# EAGLE design dev (EAGLE 4.16)
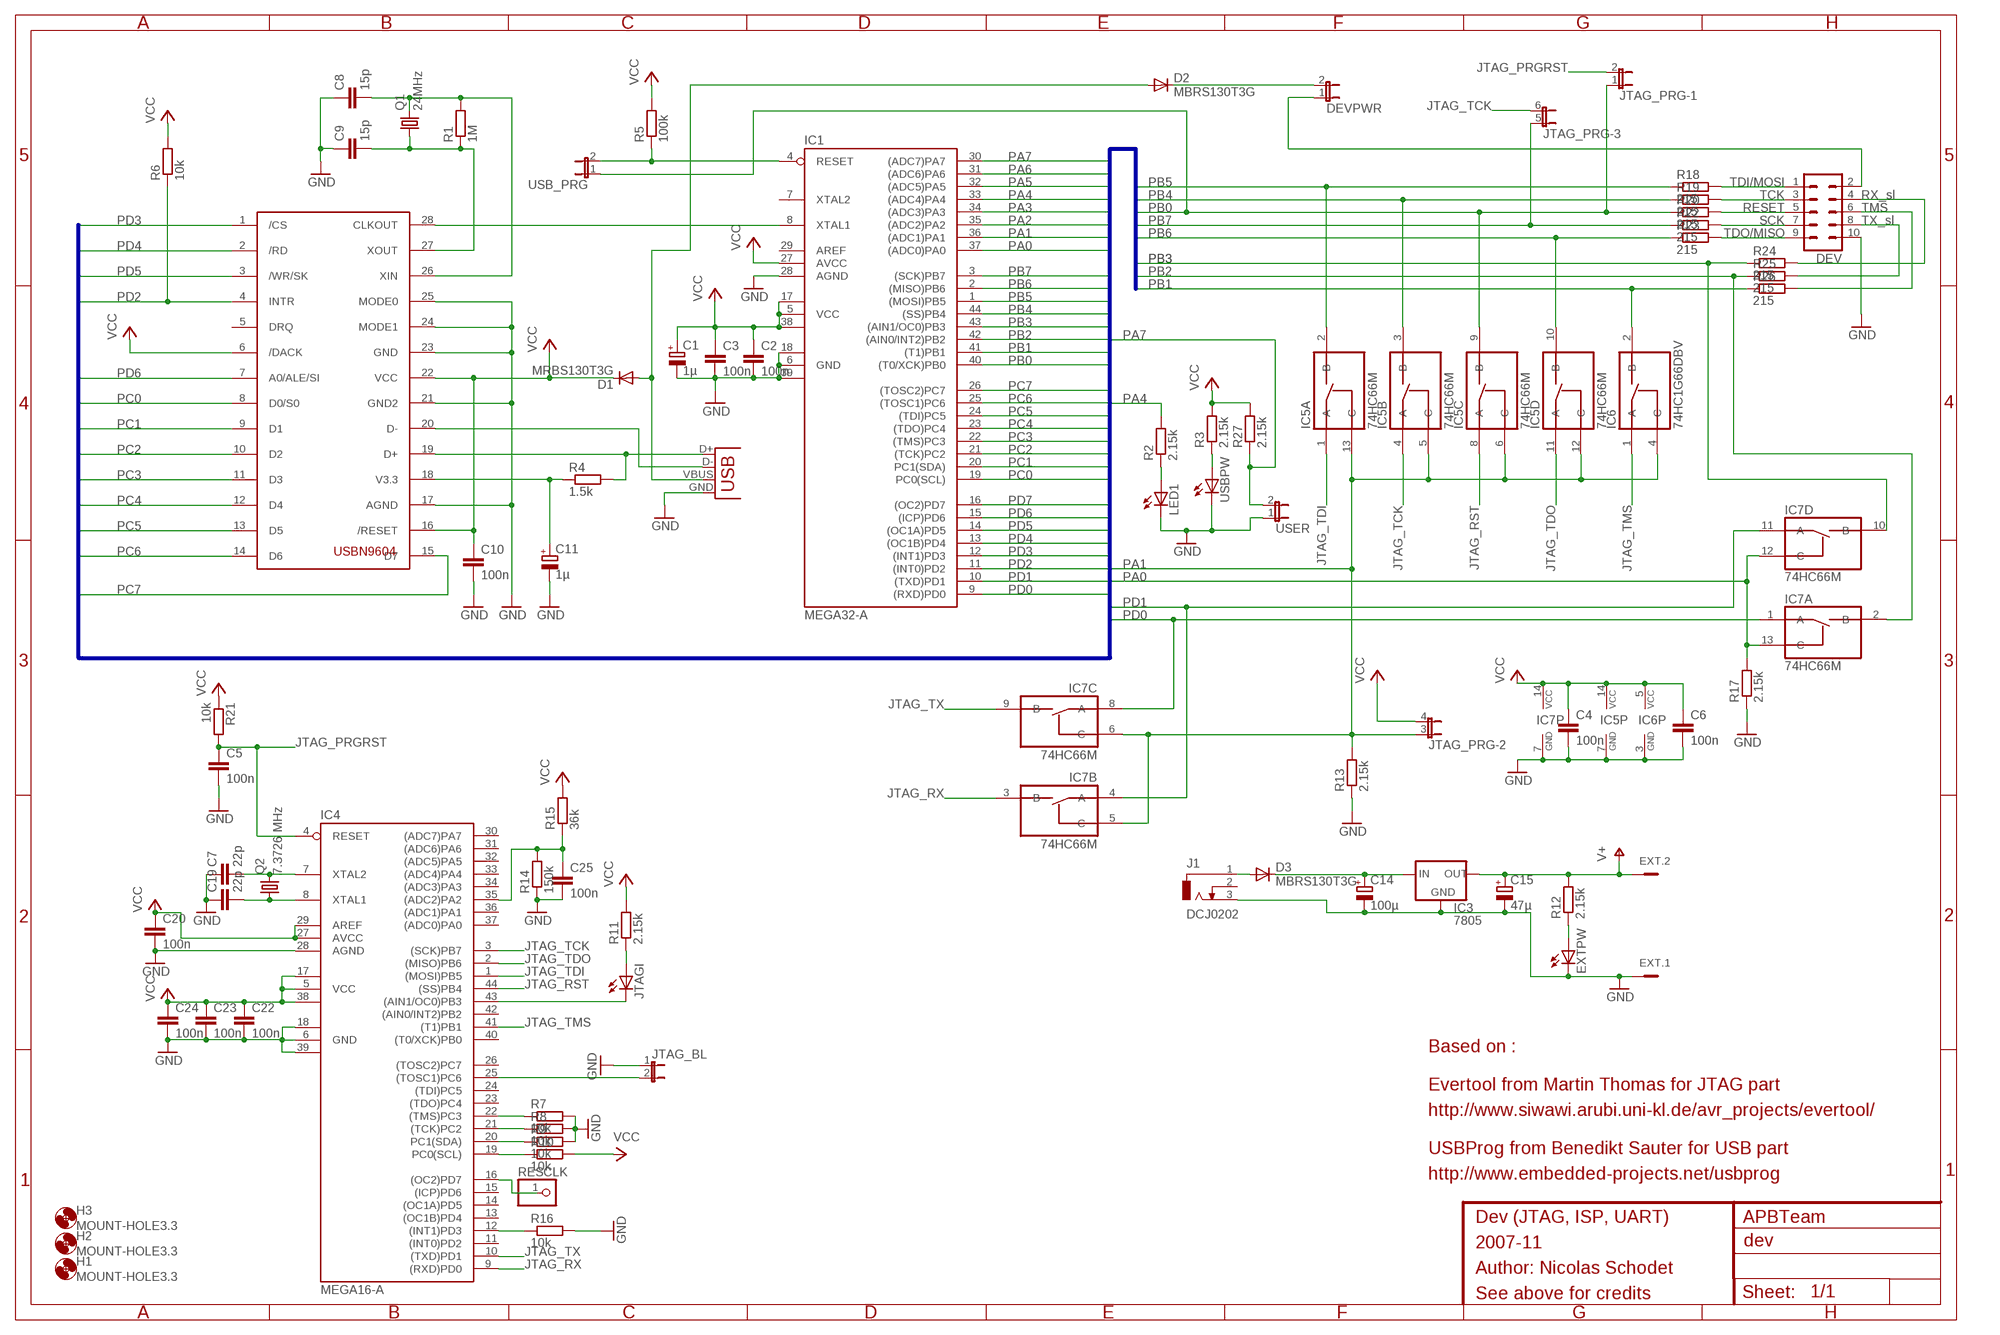
[diagram p0: schematic, sheet 1]

## Parts
C1  1µ  CPOL-EUCT3528  [CT3528]
C2  100n  C-EUC0603  [C0603]
C3  100n  C-EUC0603  [C0603]
C4  100n  C-EUC0603  [C0603]
C5  100n  C-EUC0603  [C0603]
C6  100n  C-EUC0603  [C0603]
C7  22p  C-EUC0603  [C0603]
C8  15p  C-EUC0603  [C0603]
C9  15p  C-EUC0603  [C0603]
C10  100n  C-EUC0603  [C0603]
C11  1µ  CPOL-EUCT3528  [CT3528]
C14  100µ  CPOL-EUD  [PANASONIC_D]
C15  47µ  CPOL-EUC  [PANASONIC_C]
C19  22p  C-EUC0603  [C0603]
C20  100n  C-EUC0603  [C0603]
C22  100n  C-EUC0603  [C0603]
C23  100n  C-EUC0603  [C0603]
C24  100n  C-EUC0603  [C0603]
C25  100n  C-EUC0603  [C0603]
D1  MRBS130T3G  DIODE-MELF-MLL41  [MELF-MLL41]
D2  MBRS130T3G  DIODE-MELF-MLL41  [MELF-MLL41]
D3  MBRS130T3G  DIODE-MELF-MLL41  [MELF-MLL41]
DEV  ML10L  [ML10L]
DEVPWR  JP1E  [JP1]
EXT  MC2  [MC2]
EXTPW  LEDSMT1206  [1206]
H1  MOUNT-HOLE3.3  [3,3]
H2  MOUNT-HOLE3.3  [3,3]
H3  MOUNT-HOLE3.3  [3,3]
IC1  MEGA32-A  [TQFP44]
IC2  USBN9604  [SO28-3]
IC3  7805  78XXS  [78XXS]
IC4  MEGA16-A  [TQFP44]
IC5  74HC66M  [SO14]
IC6  74HC1G66DBV  [SOT23-5]
IC7  74HC66M  [SO14]
J1  DCJ0202  [DCJ0202]
JTAG_BL  JP1E  [JP1]
JTAG_PRG  JP3QE  [JP3Q]
JTAGI  LEDSMT1206  [1206]
LED1  LEDSMT1206  [1206]
Q1  24MHz  CRYTALHC49U70  [HC49U70]
Q2  7.3726 MHz  CRYTALHC49U70  [HC49U70]
R1  1M  R-EU_R0603  [R0603]
R2  2.15k  R-EU_R0603  [R0603]
R3  2.15k  R-EU_R0603  [R0603]
R4  1.5k  R-EU_R0603  [R0603]
R5  100k  R-EU_R0603  [R0603]
R6  10k  R-EU_R0603  [R0603]
R7  10k  R-EU_R0603  [R0603]
R8  10k  R-EU_R0603  [R0603]
R9  10k  R-EU_R0603  [R0603]
R10  10k  R-EU_R0603  [R0603]
R11  2.15k  R-EU_R0603  [R0603]
R12  2.15k  R-EU_R0603  [R0603]
R13  2.15k  R-EU_R0603  [R0603]
R14  150k  R-EU_R0603  [R0603]
R15  36k  R-EU_R0603  [R0603]
R16  10k  R-EU_R0603  [R0603]
R17  2.15k  R-EU_R0603  [R0603]
R18  215  R-EU_R0603  [R0603]
R19  215  R-EU_R0603  [R0603]
R20  215  R-EU_R0603  [R0603]
R21  10k  R-EU_R0603  [R0603]
R22  215  R-EU_R0603  [R0603]
R23  215  R-EU_R0603  [R0603]
R24  215  R-EU_R0603  [R0603]
R25  215  R-EU_R0603  [R0603]
R26  215  R-EU_R0603  [R0603]
R27  2.15k  R-EU_R0603  [R0603]
RESCLK  PINHD-1X1  [1X01]
USB  USB-B-H  [USB-B-H]
USB_PRG  JP1E  [JP1]
USBPW  LEDSMT1206  [1206]
USER  JP1E  [JP1]

## Nets
GND: C1.- C2.2 C3.2 C4.2 C5.2 C6.2 C7.1 C8.1 C9.1 C10.2 C11.- C14.- C15.- C19.1 C20.2 C22.2 C23.2 C24.2 C25.2 DEV.10 EXT.1 EXTPW.C IC1.6(GND) IC1.18(GND1) IC1.28(AGND) IC1.39(GND2) IC2.17(AGND) IC2.21(GND2) IC2.23(GND) IC2.24(MODE1) IC2.25(MODE0) IC3.GND IC4.6(GND) IC4.18(GND1) IC4.28(AGND) IC4.39(GND2) IC5.7(P:GND) IC6.3(GND) IC7.7(P:GND) J1.3 JTAG_BL.1 LED1.C R7.2 R8.2 R9.2 R13.1 R14.1 R16.2 R17.1 USB.GND USBPW.C USER.1
JTAG_PRGRST: C5.1 IC4.4(RESET) JTAG_PRG.2 R21.2
JTAG_RST: IC4.44((SS)PB4) IC5.8(C:A)
JTAG_RX: IC4.9((RXD)PD0) IC7.3(B:B)
JTAG_TCK: IC4.3((SCK)PB7) IC5.4(B:A) JTAG_PRG.6
JTAG_TDI: IC4.1((MOSI)PB5) IC5.1(A:A)
JTAG_TDO: IC4.2((MISO)PB6) IC5.11(D:A)
JTAG_TMS: IC4.41((T1)PB1) IC6.1(A)
JTAG_TX: IC4.10((TXD)PD1) IC7.9(C:B)
N$1: D1.A D2.A USB.VBUS
N$2: DEV.2 DEVPWR.1
N$3: D2.C DEVPWR.2
N$4: IC1.8(XTAL1) IC2.28(CLKOUT)
N$5: DEV.9 R23.2
N$6: DEV.7 R22.2
N$7: C11.+ IC2.18(V3.3) R4.1
N$8: C8.2 IC2.26(XIN) Q1.2 R1.2
N$9: LED1.A R2.1
N$10: R3.1 USBPW.A
N$11: C9.2 IC2.27(XOUT) Q1.1 R1.1
N$12: IC2.19(D+) R4.2 USB.D+
N$13: IC4.22((TMS)PC3) R7.1
N$14: IC4.21((TCK)PC2) R8.1
N$15: IC2.20(D-) USB.D-
N$16: IC4.20(PC1(SDA)) R9.1
N$17: IC4.19(PC0(SCL)) R10.1
N$18: JTAGI.A R11.1
N$19: DEV.5 R20.2
N$20: DEV.3 R19.2
N$21: IC4.16((OC2)PD7) RESCLK.1
N$22: IC4.12((INT1)PD3) R16.1
N$23: C25.1 IC4.35((ADC2)PA2) R14.2 R15.1
N$24: IC4.25((TOSC1)PC6) JTAG_BL.2
N$25: DEV.1 R18.2
N$26: DEV.4 R24.2
N$27: D3.A J1.1
N$28: DEV.8 R25.2
N$29: DEV.6 R26.2
N$32: IC4.43((AIN1/OC0)PB3) JTAGI.C
N$33: C14.+ D3.C IC3.IN
N$36: EXTPW.A R12.1
N$53: C7.2 IC4.7(XTAL2) Q2.2
N$54: C19.2 IC4.8(XTAL1) Q2.1
PA0: IC1.37((ADC0)PA0) IC7.12(D:C) IC7.13(A:C) R17.2
PA1: IC1.36((ADC1)PA1) IC5.5(B:C) IC5.6(C:C) IC5.12(D:C) IC5.13(A:C) IC6.4(C) IC7.5(B:C) IC7.6(C:C) JTAG_PRG.3 R13.2
PA2: IC1.35((ADC2)PA2)
PA3: IC1.34((ADC3)PA3)
PA4: IC1.33((ADC4)PA4) R2.2
PA5: IC1.32((ADC5)PA5)
PA6: IC1.31((ADC6)PA6)
PA7: IC1.30((ADC7)PA7) R27.1 USER.2
PB0: IC1.40((T0/XCK)PB0) IC5.9(C:B) JTAG_PRG.1 R20.1 USB_PRG.1
PB1: IC1.41((T1)PB1) IC6.2(B) R26.1
PB2: IC1.42((AIN0/INT2)PB2) IC7.2(A:B) R25.1
PB3: IC1.43((AIN1/OC0)PB3) IC7.10(D:B) R24.1
PB4: IC1.44((SS)PB4) IC5.3(B:B) R19.1
PB5: IC1.1((MOSI)PB5) IC5.2(A:B) R18.1
PB6: IC1.2((MISO)PB6) IC5.10(D:B) R23.1
PB7: IC1.3((SCK)PB7) JTAG_PRG.5 R22.1
PC0: IC1.19(PC0(SCL)) IC2.8(D0/S0)
PC1: IC1.20(PC1(SDA)) IC2.9(D1)
PC2: IC1.21((TCK)PC2) IC2.10(D2)
PC3: IC1.22((TMS)PC3) IC2.11(D3)
PC4: IC1.23((TDO)PC4) IC2.12(D4)
PC5: IC1.24((TDI)PC5) IC2.13(D5)
PC6: IC1.25((TOSC1)PC6) IC2.14(D6)
PC7: IC1.26((TOSC2)PC7) IC2.15(D7)
PD0: IC1.9((RXD)PD0) IC7.1(A:A) IC7.8(C:A)
PD1: IC1.10((TXD)PD1) IC7.4(B:A) IC7.11(D:A)
PD2: IC1.11((INT0)PD2) IC2.4(INTR) R6.1
PD3: IC1.12((INT1)PD3) IC2.1(/CS)
PD4: IC1.13((OC1B)PD4) IC2.2(/RD)
PD5: IC1.14((OC1A)PD5) IC2.3(/WR/SK)
PD6: IC1.15((ICP)PD6) IC2.7(A0/ALE/SI)
PD7: IC1.16((OC2)PD7)
RESET: IC1.4(RESET) R5.1 USB_PRG.2
V+ [supply]: C15.+ EXT.2 IC3.OUT R12.2
VCC: C1.+ C2.1 C3.1 C4.1 C6.1 C10.1 C20.1 C22.1 C23.1 C24.1 D1.C IC1.5(VCC) IC1.17(VCC1) IC1.27(AVCC) IC1.38(VCC2) IC2.6(/DACK) IC2.16(/RESET) IC2.22(VCC) IC4.5(VCC) IC4.17(VCC1) IC4.27(AVCC) IC4.29(AREF) IC4.38(VCC2) IC5.14(P:VCC) IC6.5(VCC) IC7.14(P:VCC) JTAG_PRG.4 R3.2 R5.2 R6.2 R10.2 R11.2 R15.2 R21.1 R27.2
Unconnected: IC1.7(XTAL2) IC2.5(DRQ) IC4.11((INT0)PD2) IC4.13((OC1B)PD4) IC4.14((OC1A)PD5) IC4.15((ICP)PD6) IC4.23((TDO)PC4) IC4.24((TDI)PC5) IC4.26((TOSC2)PC7) IC4.30((ADC7)PA7) IC4.31((ADC6)PA6) IC4.32((ADC5)PA5) IC4.33((ADC4)PA4) IC4.34((ADC3)PA3) IC4.36((ADC1)PA1) IC4.37((ADC0)PA0) IC4.40((T0/XCK)PB0) IC4.42((AIN0/INT2)PB2) J1.2

## Buses
PD0,PD1,PD2,PD3,PD4,PD5,PD6,PD7,PC0,PC1,PC2,PC3,PC4,PC5,PC6,PC7,PB0,PB1,PB2,PB3,PB4,PB5,PB6,PB7,PA0,PA1,PA2,PA3,PA4,PA5,PA6,PA7

## Notes on the sheet
- TDI/MOSI
- PB4 | TCK | RX_sl
- RESET | TMS
- SCK | TX_sl
- TDO/MISO
- PB3 | PB3
- PB2
- PB1
- Based on :
- Evertool from Martin Thomas for JTAG part
- http://www.siwawi.arubi.uni-kl.de/avr_projects/evertool/
- USBProg from Benedikt Sauter for USB part
- http://www.embedded-projects.net/usbprog
- Dev (JTAG, ISP, UART) | APBTeam
- 2007-11
- Author: Nicolas Schodet
- See above for credits

## Power pins joined to a net without a drawn wire
AREF: IC1.29(AREF)

## Library data of the parts
C1 C11 C14 C15 = rcl:CPOL-EU: POLARIZED CAPACITOR, European symbol
C2-C10 C19 C20 C22-C25 = rcl:C-EU: CAPACITOR, European symbol
D1-D3 = diode:DIODE-: DIODE
DEV = con-harting-ml:ML10: HARTING
DEVPWR JTAG_BL USB_PRG USER = jumper:JP1E: JUMPER
EXT = con-phoenix-381_l:MC2: Mini-Combicon 3.81mm horizontal 2-polig MC 1,5/2-G-3,81 Artikel-Nr. 1803277
EXTPW JTAGI LED1 USBPW = led:LED: LED OSRAM: - CHIPLED LG R971, LG N971, LY N971, LG Q971, LY Q971, LO R971, LY R971 LH N974, LH R974 LS Q976, LO Q976, LY Q976 LO Q996 - Hyper CHIPLED LW Q18S LB Q993, LB Q99A, LB R99A - SideLED LS A670, LO A670, LY A670, LG A670, LP A670 LB A673, LV A673, LT A673, LW A673 LH A674 LY A675 LS A676, LA A676, LO A676, LY A676, LW A676 LS A679, LY A679, LG A679 - Hyper Micro SIDELED® LS Y876, LA Y876, LO Y876, LY Y876 LT Y87S - SmartLED LW L88C, LW L88S LB L89C, LB L89S, LG L890 LS L89K, LO L89K, LY L89K LS L896, LA L896, LO L896, LY L896 - TOPLED LS T670, LO T670, LY T670, LG T670, LP T670 LSG T670, LSP T670, LSY T670, LOP T670, LYG T670 LG T671, LOG T671, LSG T671 LB T673, LV T673, LT T673, LW T673 LH T674 LS T676, LA T676, LO T676, LY T676, LB T676, LH T676, LSB T676, LW T676 LB T67C, LV T67C, LT T67C, LS T67K, LO T67K, LY T67K, LW E67C LS E67B, LA E67B, LO E67B, LY E67B, LB E67C, LV E67C, LT E67C LW T67C LS T679, LY T679, LG T679 LS T770, LO T770, LY T770, LG T770, LP T770 LB T773, LV T773, LT T773, LW T773 LH T774 LS E675, LA E675, LY E675, LS T675 LS T776, LA T776, LO T776, LY T776, LB T776 LHGB T686 LT T68C, LB T68C - Hyper Mini TOPLED® LB M676 - Mini TOPLED Santana® LG M470 LS M47K, LO M47K, LY M47K Source: http://www.osram.convergy.de/
H1-H3 = holes:MOUNT-HOLE: MOUNTING HOLE with drill center marker
IC1 = avr:MEGA32: MICROCONTROLLER 32 Kbytes FLASH 2 Kbytes SRAM 1 Kbytes EEPROM USART 8-channel 10 bit ADC
IC2 = bene:USBN9604
IC3 = v-reg:78XXS: VOLTAGE REGULATOR
IC4 = atmel:MEGA16: MICROCONTROLLER 16 Kbytes FLASH 1 kbytes SRAM 512 bytes EEPROM USART 8-channel 10 bit ADC Source: avr.lbr
IC5 IC7 = apbteam_logic:*66: Quad bilateral ANALOG SWITCH
IC6 = apbteam_logic:*1G66: Single bilateral ANALOG SWITCH
J1 = apbteam_con-jack:DCJ0202: DC POWER JACK Source: DCJ0202.pdf
JTAG_PRG = jumper:JP3QE: JUMPER
Q1 Q2 = crystal:CRYTAL: CRYSTAL
R1-R27 = rcl:R-EU_: RESISTOR, European symbol
RESCLK = pinhead:PINHD-1X1: PIN HEADER
USB = con-usb:USB: USB Connectors

## Net classes
1 supply: width 0.508 mm

## Board
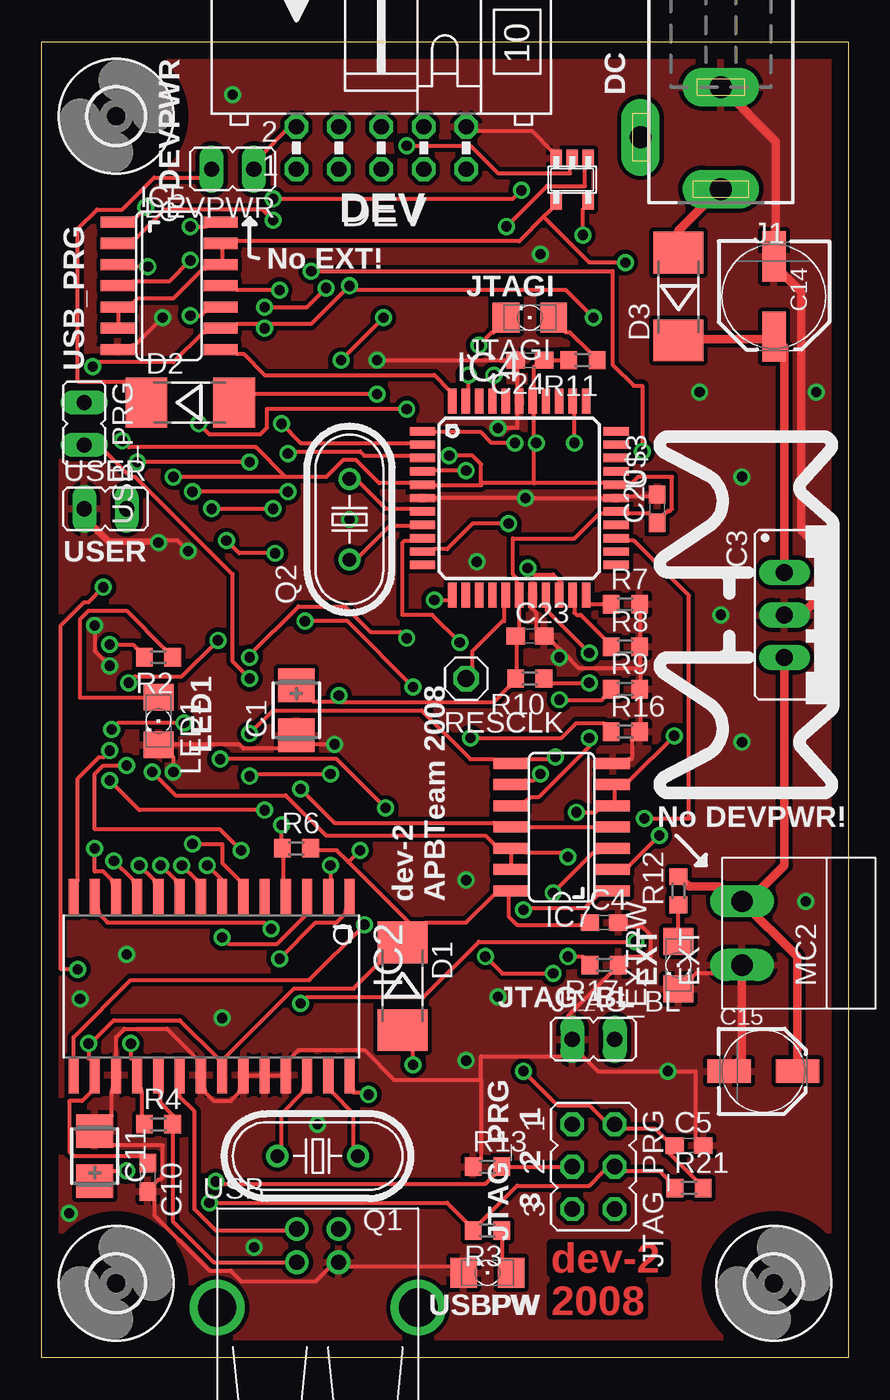
[diagram p1: board, top side]
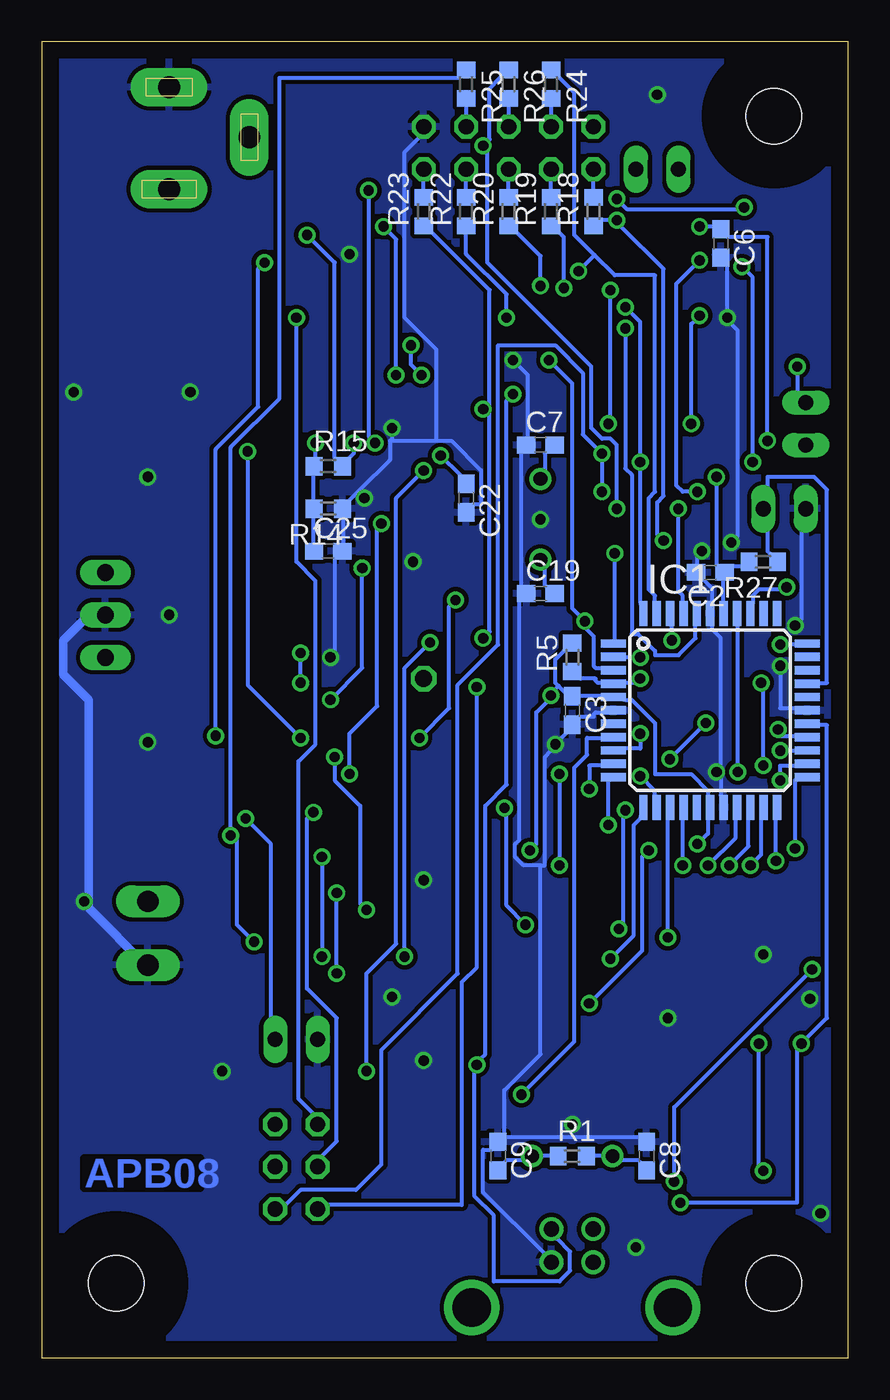
[diagram p2: board, bottom side, seen from below]

Size 48.26 x 78.74 mm. Coordinates in mm from the lower left corner, seen from the top.
Outline: 0,0 0,78.74 48.26,78.74 48.26,0 0,0
Copper layers (1*16): Top 0.035mm / dielectric 1.5mm / Bottom 0.035mm
Design rules "olimex": minimum track width 10mil, minimum drill 24mil, track to track 10mil, track to pad 10mil, pad to pad 10mil, via to via 10mil, smd to smd 10mil, copper to edge 40mil, drill to drill 10mil, minimum pad ring 10mil, minimum via ring 8mil, stop-mask expansion 0mil, vias tented up to drill 0mil, thermal gap 10mil

### Footprints (pad centres in the part's own frame; a part is rotated, then mirrored left to right if it is on the bottom)
CT3528 = smd 2 x 2.2: + 1.5,0; - -1.5,0
C0603 = smd 1.1 x 1: 1 -0.85,0; 2 0.85,0
PANASONIC_D = smd 3 x 1.4: + 2.4,0; - -2.4,0
PANASONIC_C = smd 2.6 x 1.4: + 2.05,0; - -2.05,0
MELF-MLL41 = smd 2.5 x 3: A 2.625,0; C -2.625,0
ML10L = drill 0.914 octagon: 1 -5.08,-1.27; 2 -5.08,1.27; 3 -2.54,-1.27; 4 -2.54,1.27; 5 0,-1.27; 6 0,1.27; 7 2.54,-1.27; 8 2.54,1.27; 9 5.08,-1.27; 10 5.08,1.27
JP1 = drill 0.914 long: 1 0,-1.27; 2 0,1.27
MC2 = drill 1.27 long: 1 -1.905,0; 2 1.905,0
1206 = smd 1.6 x 1.803: A -1.422,0; C 1.422,0
3,3 = hole 3.3: 0,0
TQFP44 = smd 1.5 x 0.5: 1 -5.8,4; 2 -5.8,3.2; 3 -5.8,2.4; 4 -5.8,1.6; 5 -5.8,0.8; 6 -5.8,0; 7 -5.8,-0.8; 8 -5.8,-1.6; 9 -5.8,-2.4; 10 -5.8,-3.2; 11 -5.8,-4; 23 5.8,-4; 24 5.8,-3.2; 25 5.8,-2.4; 26 5.8,-1.6; 27 5.8,-0.8; 28 5.8,0; 29 5.8,0.8; 30 5.8,1.6; 31 5.8,2.4; 32 5.8,3.2; 33 5.8,4 | smd 0.5 x 1.5: 12 -4,-5.8; 13 -3.2,-5.8; 14 -2.4,-5.8; 15 -1.6,-5.8; 16 -0.8,-5.8; 17 0,-5.8; 18 0.8,-5.8; 19 1.6,-5.8; 20 2.4,-5.8; 21 3.2,-5.8; 22 4,-5.8; 34 4,5.8; 35 3.2,5.8; 36 2.4,5.8; 37 1.6,5.8; 38 0.8,5.8; 39 0,5.8; 40 -0.8,5.8; 41 -1.6,5.8; 42 -2.4,5.8; 43 -3.2,5.8; 44 -4,5.8
SO28-3 = smd 0.61 x 2.21: 1 -8.255,-5.315; 2 -6.985,-5.315; 3 -5.715,-5.315; 4 -4.445,-5.315; 5 -3.175,-5.315; 6 -1.905,-5.315; 7 -0.635,-5.315; 8 0.635,-5.315; 9 1.905,-5.315; 10 3.175,-5.315; 11 4.445,-5.315; 12 5.715,-5.315; 13 6.985,-5.315; 14 8.255,-5.315; 15 8.255,5.315; 16 6.985,5.315; 17 5.715,5.315; 18 4.445,5.315; 19 3.175,5.315; 20 1.905,5.315; 21 0.635,5.315; 22 -0.635,5.315; 23 -1.905,5.315; 24 -3.175,5.315; 25 -4.445,5.315; 26 -5.715,5.315; 27 -6.985,5.315; 28 -8.255,5.315
78XXS = drill 1.016 long: GND 0,-2.54; IN -2.54,-2.54; OUT 2.54,-2.54
SO14 = smd 0.66 x 2.032: 1 -3.81,-3.073; 2 -2.54,-3.073; 3 -1.27,-3.073; 4 0,-3.073; 5 1.27,-3.073; 6 2.54,-3.073; 7 3.81,-3.073; 8 3.81,3.073; 9 2.54,3.073; 10 1.27,3.073; 11 0,3.073; 12 -1.27,3.073; 13 -2.54,3.073; 14 -3.81,3.073
SOT23-5 = smd 0.69 x 0.99: 1 -0.95,-1.29; 2 0,-1.29; 3 0.95,-1.29; 4 0.95,1.3; 5 -0.95,1.3
DCJ0202 = drill 1.3 pad 2.3 long: 1 0,3.1; 2 4.8,0; 3 0,-3
JP3Q = drill 0.914 octagon: 1 -2.54,-1.27; 2 -2.54,1.27; 3 0,-1.27; 4 0,1.27; 5 2.54,-1.27; 6 2.54,1.27
HC49U70 = drill 0.813 round: 1 -2.413,0; 2 2.413,0
R0603 = smd 1 x 1.1: 1 -0.85,0; 2 0.85,0
1X01 = drill 1.016 octagon: 1 0,0
USB-B-H = drill 0.914 round: D+ 0,1.25; D- 1.981,1.25; GND 0,-1.25; VBUS 1.981,-1.25 | drill 2.286 round: P$1 -2.718,-6.02; P$2 -2.718,6.02

### Placement (x,y rotation side)
C1  15.24,38.73 90 top
C2  8.26,46.99 180 bottom
C3  16.51,38.73 270 bottom
C4  33.66,26.04 0 top
C5  38.73,12.7 0 top
C6  7.62,66.67 270 bottom
C7  18.41,54.61 0 bottom
C8  12.06,12.06 270 bottom
C9  20.95,12.06 270 bottom
C10  6.35,10.79 270 top
C11  3.17,12.06 270 top
C14  43.81,63.5 270 top
C15  43.18,17.14 0 top
C19  18.41,45.72 0 bottom
C20  36.83,50.8 90 top
C22  22.86,51.44 270 bottom
C23  29.21,43.18 0 top
C24  29.21,59.69 180 top
C25  31.11,48.26 0 bottom
D1  21.59,22.23 270 top
D2  8.89,57.15 0 top
D3  38.1,63.5 90 top
DEV  20.32,72.39 0 top
DEVPWR  11.43,71.12 90 top
EXT  41.91,25.4 90 top
EXTPW  38.1,23.5 270 top
H1  4.45,74.3 0 top
H2  4.45,4.45 0 top
H3  43.81,4.45 0 top
IC1  8.26,38.73 0 bottom
IC2  10.16,22.23 180 top
IC3  46.99,44.45 270 top
IC4  28.57,51.44 0 top
IC5  7.62,64.14 270 top
IC6  31.75,70.48 180 top
IC7  31.11,31.75 90 top
J1  40.64,73.03 180 top
JTAG_BL  33.02,19.05 270 top
JTAG_PRG  33.02,11.43 270 top
JTAGI  29.21,62.23 180 top
LED1  6.99,38.1 270 top
Q1  16.51,12.06 180 top
Q2  18.41,50.16 90 top
R1  16.51,12.06 0 bottom
R2  6.99,41.91 180 top
R3  26.67,7.62 180 top
R4  6.99,13.97 0 top
R5  16.51,41.91 90 bottom
R6  15.24,30.48 0 top
R7  34.92,45.09 0 top
R8  34.92,42.55 0 top
R9  34.92,40.01 0 top
R10  29.21,40.64 180 top
R11  32.38,59.69 180 top
R12  38.1,27.94 90 top
R13  26.67,11.43 0 top
R14  31.11,50.8 180 bottom
R15  31.11,53.34 0 bottom
R16  34.92,37.47 0 top
R17  33.66,23.5 180 top
R18  15.24,68.58 90 bottom
R19  17.78,68.58 90 bottom
R20  20.32,68.58 90 bottom
R21  38.73,10.16 0 top
R22  22.86,68.58 90 bottom
R23  25.4,68.58 90 bottom
R24  17.78,76.2 270 bottom
R25  22.86,76.2 270 bottom
R26  20.32,76.2 270 bottom
R27  5.08,47.62 180 bottom
RESCLK  25.4,40.64 0 top
U$3  [PF752]  46.99,44.45 270 top
USB  16.51,5.71 90 top
USB_PRG  2.54,55.88 180 top
USBPW  26.67,5.08 180 top
USER  3.81,50.8 270 top

### Tracks (layer width: path | path; a pad name or v marks a point on that pad's centre or on a via)
GND  (via drill 0.61)
  Top 0.254: IC7.7 35.18,35.81 35.31,35.81 35.31,36.96 R16.2 35.81,37.97 35.81,39.5 R9.2 35.81,40.51 35.81,41.27 | IC4.18 29.21,44.96 29.59,44.58 29.59,43.56 C23.2 30.61,42.8 31.3,42.1 | 35.81,41.27 35.81,42.04 R8.2 35.81,43.05 35.81,44.58 R7.2 | 31.3,42.1 32.13,41.27 35.81,41.27 | C20.2 36.45,51.56 35.05,51.56 IC4.28 v28.96,51.44 IC4.6 | IC6.3 30.48,72.26 29.34,73.41 26.04,73.41 DEV.10 | v27.3,55.63 28.45,55.63 28.45,56.52 IC4.39 28.45,57.91 28.45,59.31 C24.2 v20.07,59.69 | v30.99,41.91 31.11,41.91 31.3,42.1 | v7.24,62.23 5.59,60.58 5.46,60.58 IC5.7 | v4.06,41.4 3.17,42.29 v3.17,43.81 | v17.53,36.7 16.26,36.7 C1.- 14.22,36.45 12.06,36.45 11.81,36.7 7.87,36.7 LED1.C 7.87,35.94 v7.87,35.05 | USBPW.C 24.51,5.46 18.41,5.46 USB.GND 17.14,5.33 16.38,4.57 11.94,4.57 11.3,5.21 10.03,5.21 6.73,8.51 6.73,9.4 C10.2 6.73,10.41 6.99,10.67 7.11,10.67 7.24,10.79 7.24,12.7 4.19,12.7 C11.- 4.19,14.48 4.19,15.88 IC2.17 4.45,19.18 4.95,19.68 7.49,19.68 9.27,17.91 IC2.21 9.78,15.88 10.29,15.37 11.3,15.37 11.81,15.88 IC2.23 12.32,16.89 13.08,16.89 IC2.24 13.59,16.89 14.35,16.89 IC2.25 14.86,17.91 15.37,18.41 19.3,18.41 21.08,16.64 26.29,16.64 | 26.29,16.64 26.29,18.03 31.11,18.03 JTAG_BL.1 | 26.29,16.64 26.29,11.94 R13.1 | C5.2 39.12,13.08 39.12,17.14 33.27,17.14 32.38,18.03 JTAG_BL.1 | JTAG_BL.1 31.5,20.45 34.04,22.99 R17.1 34.92,24 36.45,24 36.45,25.27 35.94,25.78 35.05,25.78 C4.2 | EXTPW.C 38.99,22.86 39.12,22.99 40.13,22.99 EXT.1 | v8.76,48.26 8.13,48.9 4.06,48.9 3.17,49.78 USER.1 3.05,49.66 3.94,48.77 v6.99,48.77
  Top 0.508: C15.- 41.91,17.93 EXT.1 | 43.94,65.79 43.93,65.79 C14.- 43.83,65.9 43.94,65.79 | IC3.GND 45.47,44.45 46.99,45.97 46.99,48.01 45.47,49.53 45.47,63.75 43.94,65.28 43.94,65.79 | 43.94,65.79 43.94,72.77 40.69,76.03 J1.3
  Bottom 0.254: 27.3,54.86 27.43,54.86 27.43,53.72 29.27,51.88 | 27.3,54.86 24.64,54.86 | 24.64,54.86 23.75,54.86 21.97,53.09 21.97,51.05 22.48,51.05 C22.2 | 29.27,51.88 29.84,51.31 R14.1 30.23,50.29 30.23,48.64 C25.2 30.73,47.88 30.73,42.16 v30.99,41.91 | v27.3,55.63 27.3,54.86 | 24.64,54.86 24.64,60.33 26.54,62.23 26.54,72.14 25.65,73.03 DEV.10 | v28.96,51.44 29.21,51.69 29.21,51.82 29.27,51.88 | C6.2 7.24,65.28 v7.24,62.23 6.99,61.85 6.6,61.47 6.6,49.15 v6.99,48.77 | v4.06,41.4 4.06,38.86 3.17,38.86 IC1.28 | v3.17,43.81 2.79,44.2 2.79,49.4 USER.1 | 7.62,35.05 7.62,43.05 8.13,43.56 8.13,43.81 IC1.39 8.13,45.21 8.13,46.01 C2.2 9.02,46.99 9.02,48.01 v8.76,48.26 | 7.62,35.05 7.62,33.66 IC1.18 | IC1.6 14.73,38.61 15.11,38.61 15.24,38.48 15.24,38.35 16.13,38.35 C3.2 16.89,37.34 v17.53,36.7 17.78,36.32 18.16,35.94 18.16,29.46 18.41,29.46 | 18.41,29.46 19.43,29.46 19.94,29.97 19.94,30.73 19.68,30.99 19.68,45.34 C19.1 19.56,46.1 19.56,54.23 C7.1 19.18,54.99 19.18,58.8 v20.07,59.69 | v7.87,35.05 7.62,35.05 | C8.1 12.45,13.21 20.57,13.21 C9.1 | C9.1 21.34,12.45 21.84,12.45 21.84,9.91 18.16,6.22 USB.GND | 18.41,29.46 18.41,18.16 20.57,16 20.57,13.46 C9.1
  Bottom 0.508: IC3.GND 45.47,44.45 46.99,42.93 46.99,40.89 45.47,39.37 45.47,26.92 41.91,23.37 EXT.1
  other vias: 5.08,24.13 10.79,20.32 25.4,17.78 16.51,13.97 12.7,6.6 39.37,57.78 41.91,52.7 41.91,36.83 40.64,44.45 45.72,27.3 46.35,57.78 37.47,17.14 27.3,21.59 25.4,28.57 29.84,66.04 26.04,47.62 18.41,50.16 11.43,75.56 2.29,21.46 1.65,8.64
  pour Top (isolate 0.254): 0,78.74 48.26,78.74 48.26,0 0,0
  pour Bottom (isolate 0.254): 0,78.74 48.26,78.74 48.26,0 0,0
JTAG_PRGRST  (via drill 0.61)
  Top 0.254: v25.4,53.09 23.5,53.09 IC4.4 | v28.83,17.14 30.86,15.11 32.77,15.11 33.66,14.22 JTAG_PRG.2 34.92,13.72 36.7,13.72 37.34,13.08 C5.1 37.47,12.32 39.12,10.67 R21.2
  Bottom 0.254: v25.4,53.09 27.05,51.44 27.05,24.77 28.83,22.99 v28.83,17.14
JTAG_RST
  Top 0.254: IC4.44 24.38,57.91 23.5,58.8 13.34,58.8 12.06,60.07 11.68,60.07 IC5.8
JTAG_RX  (via drill 0.61)
  Top 0.254: v25.02,42.8 23.37,44.45 21.59,44.45 21.59,48.77 21.72,48.9 22.1,48.9 IC4.9 | v26.54,24 27.56,22.99 v30.61,22.99 | v30.61,27.81 33.02,30.23 33.27,30.23 IC7.3
  Bottom 0.254: v25.02,42.8 26.54,41.27 v26.54,24 | v30.61,22.99 v30.61,27.81
JTAG_TCK  (via drill 0.61)
  Top 0.254: v14.73,54.1 14.86,54.23 19.05,54.23 19.3,53.98 22.1,53.98 IC4.3 | v8.89,65.66 7.62,64.39 5.46,64.39 IC5.4 | v14.73,51.82 v9.02,51.82
  Bottom 0.254: JTAG_PRG.6 33.66,9.14 32.77,10.03 29.46,10.03 27.94,11.56 27.94,18.41 23.37,22.99 23.37,40.26 20.95,42.67 20.95,60.58 17.53,60.58 15.88,58.93 15.88,55.24 v14.73,54.1 v14.73,51.82 | v8.89,65.66 10.29,64.26 10.29,52.2 9.91,51.82 v9.02,51.82
JTAG_TDI  (via drill 0.61)
  Top 0.254: v28.32,54.74 26.92,54.74 26.29,55.37 23.5,55.37 IC4.1 | v28.7,69.85 28.19,69.34 v13.84,69.34 | v6.22,68.83 5.59,68.2 5.46,68.2 IC5.1
  Bottom 0.254: v28.32,54.74 28.7,55.12 v28.7,69.85 | v13.84,69.34 13.21,68.71 6.22,68.71 v6.22,68.83
JTAG_TDO  (via drill 0.61)
  Top 0.254: v14.35,55.88 15.49,54.74 22.1,54.74 IC4.2 | v14.22,63.88 11.68,63.88 IC5.11
  Bottom 0.254: v14.35,55.88 14.22,56.01 v14.22,63.88
JTAG_TMS  (via drill 0.61)
  Top 0.254: v27.81,67.69 30.23,70.1 32.51,70.1 32.51,71.37 IC6.1 | v27.05,58.8 27.05,57.91 IC4.41
  Bottom 0.254: v27.81,67.69 27.05,66.93 v27.05,58.8
JTAG_TX  (via drill 0.61)
  Top 0.254: v27.94,49.91 25.78,49.91 24.26,48.39 23.5,48.39 IC4.10 | v29.84,34.92 29.46,34.54 28.96,34.54 IC7.9
  Bottom 0.254: v27.94,49.91 28.19,49.66 28.19,38.99 29.84,37.34 v29.84,34.92
N$1  (via drill 0.61)
  Top 0.254: v22.23,17.53 22.23,18.41 D1.A | v20.07,57.66 12.7,57.66 D2.A
  Bottom 0.254: USB.VBUS 17.4,7.11 16.64,6.35 16.64,5.21 17.27,4.57 21.21,4.57 21.21,8.51 22.35,9.65 22.35,17.4 v22.23,17.53 21.97,17.91 21.72,18.16 21.72,33.02 20.45,34.29 20.45,57.28 v20.07,57.66
N$2
  Top 0.254: DEVPWR.1 13.34,72.14 14.61,73.41 DEV.2
N$3
  Top 0.254: DEVPWR.2 9.53,70.61 6.73,70.61 4.83,68.71 3.3,68.71 2.16,67.56 2.16,58.42 5.08,58.42 D2.C
N$4  (via drill 0.61)
  Top 0.254: v19.56,15.75 19.43,15.88 18.67,15.88 IC2.28
  Bottom 0.254: v19.56,15.75 16.38,18.92 16.38,35.31 15.62,36.07 15.62,37.08 14.73,37.08 IC1.8
N$5
  Bottom 0.254: R23.2 DEV.9
N$6
  Bottom 0.254: R22.2 DEV.7
N$7  (via drill 0.61)
  Top 0.254: R4.1 5.97,14.48 5.97,15.88 IC2.18 5.46,17.91 5.33,17.91 v5.33,18.8 | v5.08,11.18 4.19,11.18 C11.+
  Bottom 0.254: v5.08,11.18 5.33,11.43 v5.33,18.8
N$8
  Top 0.254: IC2.26 15.62,15.88 14.35,14.61 14.35,12.7 Q1.2
  Bottom 0.254: C8.2 12.45,11.68 12.57,11.81 13.46,11.81 Q1.2 R1.2
N$9
  Top 0.254: R2.1 7.37,42.42 5.08,44.7 2.79,44.7 2.29,44.2 2.29,39.5 6.1,39.5 LED1.A
N$10
  Top 0.254: R3.1 27.56,7.11 27.56,5.97 USBPW.A
N$11
  Top 0.254: IC2.27 17.4,15.88 18.67,14.61 18.67,12.7 Q1.1
  Bottom 0.254: R1.1 Q1.1 19.56,11.81 20.45,11.81 20.57,11.68 C9.2
N$12
  Top 0.254: USB.D+ 10.29,5.71 7.87,8.13 7.87,13.97 R4.2 7.83,14.52 7.11,15.24 7.11,16.51 6.86,16.76 6.99,16.89 IC2.19
N$13
  Top 0.254: R7.1 32.77,45.09 IC4.22
N$14
  Top 0.254: R8.1 33.66,43.05 32.26,44.45 32,44.45 31.88,44.58 31.88,44.96 IC4.21
N$15
  Top 0.254: IC2.20 8.26,15.62 9.14,14.73 9.14,8.89 10.41,7.62 15.24,7.62 15.26,7.64 USB.D-
N$16  (via drill 0.61)
  Top 0.254: v30.99,39.37 33.53,39.37 33.66,39.5 R9.1 | v29.08,47.24 29.46,46.86 30.61,46.86 31.11,46.35 IC4.20
  Bottom 0.254: v30.99,39.37 29.08,41.27 v29.08,47.24
N$17  (via drill 0.61)
  Top 0.254: v32.77,40.39 30.48,40.39 R10.1 | v32.77,42.16 30.23,44.7 30.23,44.96 IC4.19
  Bottom 0.254: v32.77,40.39 v32.77,42.16
N$18
  Top 0.254: R11.1 32.77,60.2 31.62,61.34 31.37,61.34 JTAGI.A
N$19
  Bottom 0.254: R20.2 DEV.5
N$20
  Bottom 0.254: R19.2 DEV.3
N$21
  Top 0.254: IC4.16 27.69,44.96 27.69,44.07 27.56,44.07 25.78,42.29 25.78,41.27 RESCLK.1
N$22  (via drill 0.61)
  Top 0.254: v25.65,37.08 31.11,37.08 32,37.97 33.66,37.97 R16.1 | v23.5,45.34 24.38,45.34 IC4.12
  Bottom 0.254: v25.65,37.08 23.88,38.86 23.88,44.96 v23.5,45.34
N$23  (via drill 0.61)
  Top 0.254: v31.88,54.74 31.88,56.52 IC4.35
  Bottom 0.254: C25.1 32,48.64 32,50.29 R14.2 32,51.31 32,52.83 R15.1 31.88,53.85 v31.88,54.74
N$24  (via drill 0.61)
  Top 0.254: v36.07,32.26 38.73,32.26 38.73,45.59 35.43,48.9 35.05,48.9 IC4.25
  Bottom 0.254: v36.07,32.26 34.54,30.73 34.54,20.45 JTAG_BL.2
N$25
  Bottom 0.254: R18.2 DEV.1
N$26
  Bottom 0.254: R24.2 DEV.4
N$27
  Top 0.508: 38.1,66.04 D3.A 38.1,67.44 40.59,69.92 J1.1
N$28
  Bottom 0.254: R25.2 DEV.8
N$29
  Bottom 0.254: R26.2 DEV.6
N$32  (via drill 0.61)
  Top 0.254: v25.53,58.8 25.53,57.91 IC4.43 | v26.16,60.58 26.92,61.34 27.05,61.34 JTAGI.C
  Bottom 0.254: v25.53,58.8 26.16,59.44 v26.16,60.58
N$33
  Top 0.508: D3.C 38.19,60.96 43.69,60.96 43.69,60.97 C14.+ 44.45,60.47 IC3.IN
N$36
  Top 0.254: EXTPW.A R12.1
N$53
  Top 0.254: IC4.7 22.1,50.8 20.57,50.8 19.05,52.32 Q2.2
  Bottom 0.254: C7.2 18.03,54.23 18.16,54.1 18.16,53.21 Q2.2
N$54
  Top 0.254: IC4.8 22.1,49.78 20.83,49.78 19.05,48.01 Q2.1
  Bottom 0.254: C19.2 18.03,46.1 18.16,46.23 18.16,47.12 Q2.1
PA0  (via drill 0.61)
  Top 0.254: v31.5,24 32.38,24 R17.2 | v31.5,29.97 31.24,30.23 28.96,30.23 IC7.12 | v6.6,35.05 8,33.66 14.61,33.66 17.02,31.24 26.54,31.24 27.05,30.73 IC7.12 | IC7.13 28.07,29.46 28.07,30.23 IC7.12
  Bottom 0.254: v31.5,29.97 v31.5,24 | v6.6,35.05 6.6,43.81 IC1.37
PA1  (via drill 0.61)
  Top 0.254: IC5.6 4.57,61.85 4.57,62.61 IC5.5 5.46,63.12 5.71,63.37 7.87,63.37 9.65,65.15 9.78,65.15 IC5.12 10.79,65.66 10.79,66.42 IC5.13 11.68,66.8 28.57,66.8 30.04,68.26 | 30.04,68.26 30.48,68.71 IC6.4 | JTAG_PRG.3 R13.2 27.05,10.92 26.54,10.41 10.54,10.41 v10.41,10.54 | v3.68,46.1 2.79,45.21 2.54,45.21 1.14,43.81 1.14,23.24 v2.16,23.24 | v32,32.64 33.15,32.64 33.27,32.77 IC7.5 34.29,33.27 34.29,34.04 IC7.6 35.18,34.54 v37.85,37.21 | v34.92,65.53 32.77,65.53 30.04,68.26
  Bottom 0.254: v3.68,46.1 3.68,45.97 5.33,45.97 5.71,45.59 5.71,45.21 IC1.36 | v2.16,23.24 10.41,14.99 v10.41,10.54 | v32,32.64 32.38,32.26 32.38,22.1 30.61,20.32 30.61,12.95 31.5,12.06 JTAG_PRG.3 | v34.92,65.53 35.31,65.15 35.31,56.9 37.85,54.36 v37.85,37.21
PA4  (via drill 0.61)
  Top 0.254: v4.06,42.67 5.46,42.67 5.71,42.42 R2.2
  Bottom 0.254: v4.06,42.67 3.17,42.67 IC1.33
PA7
  Bottom 0.254: IC1.30 1.78,40.39 1.27,40.39 1.27,51.94 2.03,52.7 4.83,52.7 4.83,52.2 USER.2 4.83,49.4 4.83,48.26 4.7,48.13 R27.1
PB0  (via drill 0.61)
  Top 0.254: 13.34,61.85 11.68,61.85 IC5.9 9.78,61.34 9.65,61.34 7.87,59.56 3.3,59.56 v3.05,59.31 | 13.34,61.85 16.13,61.85 v18.41,64.14 18.8,63.88 31.37,63.88 v33.02,62.23 | 13.34,61.85 v13.34,61.59
  Bottom 0.254: v18.41,64.14 18.41,65.91 19.81,67.31 R20.1 | v13.34,61.59 13.34,53.21 12.95,52.83 12.95,43.31 12.57,43.31 11.56,42.29 11.56,42.04 10.16,42.04 9.14,43.05 9.14,43.81 IC1.40 | v33.02,62.23 33.02,47.62 31.88,46.48 31.88,36.7 32.89,35.69 32.89,15.49 32,14.61 JTAG_PRG.1 | v3.05,59.31 3.05,57.78 USB_PRG.1
PB1  (via drill 0.61)
  Top 0.254: v21.84,72.52 25.65,72.52 27.3,70.87 31.62,70.87 31.62,71.37 IC6.2 | v10.16,50.8 v13.84,50.8
  Bottom 0.254: R26.1 20.83,76.58 21.46,75.95 21.46,72.9 v21.84,72.52 21.59,72.52 21.59,65.53 15.37,59.31 15.37,55.63 14.73,54.99 14.22,54.99 13.84,54.61 v13.84,50.8 | IC1.41 9.91,44.59 9.91,45.59 10.16,45.85 v10.16,50.8
PB2  (via drill 0.61)
  Top 0.254: v36.96,31.24 35.18,29.46 IC7.2 | v10.54,42.93 8.38,40.77 5.59,40.77 v5.21,40.39 | v5.08,35.43 3.68,35.43 3.17,34.92 3.17,31.62 10.67,31.62 v11.94,30.35 | v15.49,21.21 15.88,21.59 22.86,21.59 26.16,24.89 v35.56,24.89
  Bottom 0.254: R25.1 23.37,76.58 34.04,76.58 34.04,57.4 36.96,54.48 v36.96,31.24 36.58,30.99 36.58,25.91 v35.56,24.89 | v10.54,42.93 10.54,43.81 IC1.42 | v5.21,40.39 5.08,40.26 v5.08,35.43 | v11.94,30.35 12.32,29.97 12.32,24.38 v15.49,21.21
PB3  (via drill 0.61)
  Top 0.254: v32.77,37.08 32.77,36.58 29.72,33.53 29.21,33.53 28.96,33.27 IC7.10 | v35.94,54.23 35.94,58.17 35.43,58.17 34.16,59.44 34.16,65.02 v16.13,65.02
  Bottom 0.254: 15.18,65.98 13.97,64.77 11.56,64.77 11.56,51.82 11.94,51.44 11.94,45.97 11.56,45.59 11.56,45.21 IC1.43 | 15.18,65.98 16.38,67.18 16.38,75.69 17.27,76.58 R24.1 | v32.77,37.08 35.94,40.26 v35.94,54.23 | 15.18,65.98 v16.13,65.02
PB4  (via drill 0.61)
  Top 0.254: v17.02,64.01 15.88,62.87 v13.34,62.87 | v6.35,65.28 5.46,65.28 IC5.3 | v12.45,53.59 v5.71,53.59
  Bottom 0.254: v17.02,64.01 17.02,67.06 17.27,67.31 R19.1 | v13.34,62.87 12.45,61.98 v12.45,53.59 12.45,45.21 IC1.44 | v6.35,65.28 5.71,64.64 v5.71,53.59
PB5  (via drill 0.61)
  Top 0.254: v13.84,68.07 13.21,68.71 7.37,68.71 5.59,66.93 5.46,66.93 IC5.2 | v13.97,48.13 11.81,48.13 v11.05,48.9
  Bottom 0.254: R18.1 14.73,68.07 v13.84,68.07 13.59,67.69 11.05,65.15 11.05,51.56 11.43,51.18 11.43,49.28 v11.05,48.9 | v13.97,48.13 13.97,42.93 IC1.1
PB6  (via drill 0.61)
  Top 0.254: v21.84,43.05 21.46,43.43 19.68,43.43 18.16,44.96 15.37,44.96 12.45,42.04 v12.45,41.91 | v8.89,62.36 9.53,62.36 9.78,62.61 IC5.10 | v9.4,55.88 10.03,55.24 13.08,55.24 13.46,55.63 13.46,56.77 v21.84,56.77
  Bottom 0.254: 21.46,56.77 21.46,43.43 v21.84,43.05 | 21.46,56.77 21.46,63.88 24.89,67.31 R23.1 | v12.45,41.91 13.34,41.91 IC1.2 | v8.89,62.36 9.4,61.85 v9.4,55.88 | 21.46,56.77 v21.84,56.77
PB7  (via drill 0.61)
  Top 0.254: v17.91,59.69 v20.45,62.23 | v22.23,40.13 18.29,44.07 v15.75,44.07
  Bottom 0.254: v20.45,62.23 20.45,63.63 22.86,66.04 R22.1 | v17.91,59.69 16.51,58.29 16.51,44.83 v15.75,44.07 15.75,43.69 15.24,43.18 15.24,41.4 15.11,41.27 14.73,41.27 IC1.3 | v22.23,40.13 22.23,23.37 23.11,22.48 23.11,9.14 31.11,9.14 JTAG_PRG.5
PC0  (via drill 0.61)
  Top 0.254: v8.38,29.46 9.27,28.57 IC2.8
  Bottom 0.254: v8.38,29.46 6.73,31.11 6.73,32.26 IC1.19
PC1  (via drill 0.61)
  Top 0.254: v7.11,29.46 8,28.57 IC2.9
  Bottom 0.254: v7.11,29.46 5.97,30.61 5.97,32.26 IC1.20
PC2  (via drill 0.61)
  Top 0.254: v5.84,29.46 6.73,28.57 IC2.10
  Bottom 0.254: v5.84,29.46 5.21,30.1 5.21,32.26 IC1.21
PC3  (via drill 0.61)
  Top 0.254: v4.32,29.72 5.46,28.57 IC2.11
  Bottom 0.254: v4.32,29.72 4.32,32.26 IC1.22
PC4  (via drill 0.61)
  Top 0.254: v3.17,30.48 3.17,29.08 3.68,29.08 4.19,28.57 IC2.12
  Bottom 0.254: v3.17,30.48 3.17,34.54 IC1.23
PC5  (via drill 0.61)
  Top 0.254: v4.06,34.54 5.84,32.77 v13.34,32.77 | v13.72,25.65 13.34,26.04 3.94,26.04 3.43,26.54 IC2.13
  Bottom 0.254: v4.06,34.54 4.06,35.43 3.17,35.43 IC1.24 | v13.34,32.77 13.46,32.64 13.46,25.91 v13.72,25.65
PC6  (via drill 0.61)
  Top 0.254: v4.06,36.32 3.68,35.94 3.43,35.94 2.16,34.67 2.16,28.57 IC2.14
  Bottom 0.254: v4.06,36.32 3.17,36.32 IC1.25
PC7  (via drill 0.61)
  Top 0.254: v4.19,37.59 4.57,37.97 v8.51,37.97 | v10.67,35.81 17.65,35.81 v20.57,32.89 | v19.3,25.91 16,22.61 5.33,22.61 1.91,19.18 IC2.15
  Bottom 0.254: v4.19,37.59 4.19,37.21 3.17,37.21 IC1.26 | v10.67,35.81 v8.51,37.97 | v20.57,32.89 20.45,32.77 20.45,27.05 v19.3,25.91
PD0  (via drill 0.61)
  Top 0.254: v12.45,37.34 13.84,38.73 22.73,38.73 25.65,35.81 27.05,35.81 IC7.8 28.96,35.81 30.61,35.81 v30.73,35.94 | v28.83,26.8 28.96,26.92 32.51,26.92 33.27,27.69 IC7.1
  Bottom 0.254: v12.45,37.34 12.45,36.45 13.34,36.45 IC1.9 | v28.83,26.8 29.21,27.18 29.21,33.02 30.73,34.54 v30.73,35.94
PD1  (via drill 0.61)
  Top 0.254: v15.49,34.04 17.53,32 27.05,32 IC7.11 IC7.4
  Bottom 0.254: v15.49,34.04 15.49,35.43 14.73,35.43 IC1.10
PD2  (via drill 0.61)
  Top 0.254: IC2.4 14.48,28.57 14.48,29.97 R6.1 14.35,30.99 v14.35,31.88
  Bottom 0.254: v14.35,31.88 14.35,34.54 IC1.11
PD3  (via drill 0.61)
  Top 0.254: v14.22,23.88 16.38,26.04 17.65,26.04 18.16,26.54 IC2.1
  Bottom 0.254: v14.22,23.88 12.83,25.27 12.83,31.88 12.45,32.26 IC1.12
PD4  (via drill 0.61)
  Top 0.254: v12.45,34.8 12.57,34.92 v17.27,34.92 | v17.27,29.46 17.27,28.57 IC2.2
  Bottom 0.254: v12.45,34.8 11.56,33.91 11.56,33.66 IC1.13 | v17.27,34.92 v17.27,29.46
PD5  (via drill 0.61)
  Top 0.254: v10.79,25.15 11.18,24.77 14.1,24.77 15.88,26.54 IC2.3
  Bottom 0.254: v10.79,25.15 10.79,32.26 IC1.14
PD6  (via drill 0.61)
  Top 0.254: v9.91,29.46 10.79,28.57 IC2.7
  Bottom 0.254: v9.91,29.46 9.91,32.26 IC1.15
RESET  (via drill 0.61)
  Top 0.254: v12.45,40.64 11.43,41.66 11.43,46.86 5.59,52.7 5.33,52.7 3.81,54.23 USB_PRG.2
  Bottom 0.254: R5.1 16,40.64 15.11,40.64 15.11,40.51 14.99,40.39 14.73,40.39 IC1.4 13.34,40.39 12.45,40.39 v12.45,40.64
V+
  Top 0.508: IC3.OUT 44.45,29.46 42.42,27.43 41.91,27.18 EXT.2 | C15.+ 45.21,17.16 45.21,24 EXT.2 | R12.2 38.61,28.32 38.73,28.19 40.51,28.19 EXT.2
VCC  (via drill 0.61)
  Top 0.254: C4.1 32.26,25.91 28.45,25.91 27.94,26.42 27.94,27.69 IC7.14 27.05,27.69 25.4,26.04 22.99,26.04 D1.C | 18.35,29.65 21.97,26.04 D1.C | 18.35,29.65 17.65,30.35 16.51,30.35 R6.2 | C10.1 5.97,12.06 1.91,12.06 1.65,12.32 1.65,15.37 2.41,15.37 2.92,15.88 IC2.16 2.92,17.91 2.79,17.91 v2.79,18.8 3.17,19.05 4.32,20.19 8.26,20.19 10.54,17.91 IC2.22 10.92,17.91 15.11,22.1 18.67,22.1 20.19,23.62 D1.C | v10.03,9.27 24.26,9.27 25.4,8.13 R3.2 26.29,8.13 28.45,10.29 32.77,10.29 33.66,11.18 JTAG_PRG.4 34.92,11.18 36.96,11.18 37.47,10.67 R21.1 | v9.02,30.73 10.79,30.73 10.79,29.59 11.81,28.57 IC2.6 | 17.78,39.24 27.05,39.24 27.94,40.13 R10.2 28.45,41.15 28.45,42.8 C23.1 28.57,43.56 IC4.17 28.45,46.35 28.45,46.61 28.19,46.86 28.19,49.02 31.88,49.02 33.4,50.55 33.66,50.55 IC4.27 35.05,50.55 36.32,50.55 36.45,50.42 C20.1 37.21,50.42 37.47,50.67 37.59,50.67 37.72,50.8 37.72,52.7 35.69,52.7 35.31,52.32 35.05,52.32 IC4.29 33.66,52.32 29.46,52.32 | 17.78,39.24 16.26,39.24 C1.+ | v32.38,67.18 32.38,68.71 IC6.5 | R11.2 C24.1 29.59,59.31 29.46,59.31 29.46,57.91 IC4.38 29.46,56.52 29.46,54.74 | v8.89,67.69 9.78,67.69 IC5.14 | v24.38,53.98 25.78,53.98 26.29,53.47 26.29,52.32 | 26.29,52.32 26.29,52.2 23.5,52.2 IC4.5 22.1,52.32 20.19,52.32 18.8,53.72 18.03,53.72 17.02,52.7 14.61,52.7 | 29.46,52.32 26.29,52.32 | 14.61,52.7 v7.87,52.7 | v4.83,54.86 5.21,54.48 12.83,54.48 14.61,52.7 | 29.46,52.32 29.46,54.74 | 29.46,54.74 v29.59,54.74 | v17.78,39.62 17.78,39.24 | 18.35,29.65 v19.05,30.35
  Bottom 0.254: IC1.27 1.78,37.85 1.27,37.85 1.27,20.32 v2.79,18.8 3.05,18.41 3.05,9.27 v10.03,9.27 | 17.34,40.2 16.89,39.75 C3.1 16.13,39.62 14.73,39.62 IC1.5 13.34,39.37 12.95,39.37 11.56,37.97 11.56,34.92 9.4,34.92 8.38,33.91 8.38,33.66 IC1.17 8.38,32.26 8.38,31.37 v9.02,30.73 | 17.34,40.2 17.53,40.39 17.53,41.78 17.02,42.29 R5.2 | v32.38,67.18 30.73,65.53 30.73,53.85 R15.2 29.84,53.85 29.59,54.1 v29.59,54.74 | v8.89,67.69 8,67.69 C6.1 7.24,67.06 4.83,67.06 v4.83,54.86 | v24.38,53.98 23.24,52.83 C22.1 | 17.34,40.2 17.78,39.75 v17.78,39.62 18.03,39.24 18.67,38.61 18.67,30.73 v19.05,30.35 | R27.2 6.35,47.37 6.86,47.37 C2.1 | IC1.38 7.49,45.21 7.49,46.61 C2.1 | C2.1 7.87,47.37 v7.87,52.7

### Text on the board
Top: dev-2 | 2008
Bottom: APB08
_tSilk: DC | DEVPWR | DEV | No EXT! | JTAGI | USB_PRG | USER | LED1 | No DEVPWR! | dev-2 | APBTeam 2008 | EXT | JTAG_BL | 1 | 2 | 3 | JTAG_PRG | USBPW